# Altium schematic sheet I2C P Sensor.SchDoc: Air Pressure Sensor
size 292 x 193 mm; SheetNumber: 11; SheetTotal: 21
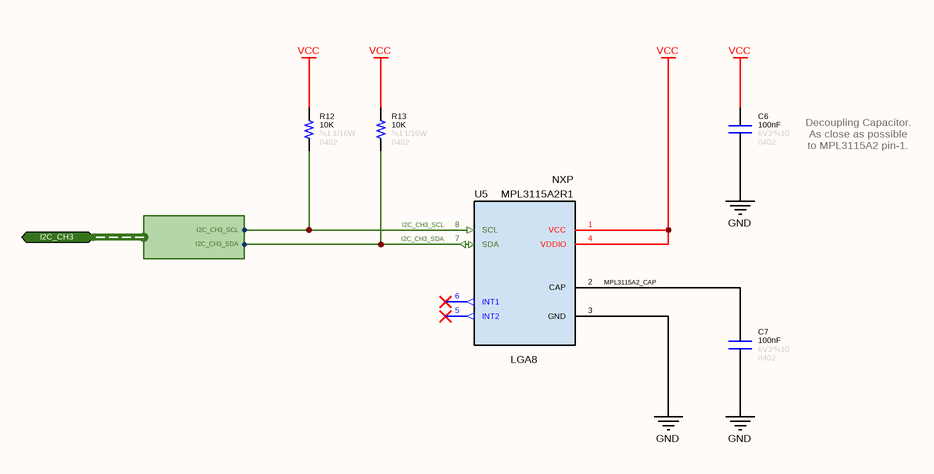
[diagram p0: I2C P Sensor.SchDoc]

## Parts
C6  value 100nF  Tolerance: %10  Voltage: 6V3  Case: 0402  [CAPACITOR_0402]  (hidden comment: Capacitor - 100nF [0402] (Ceramic))
C7  value 100nF  Tolerance: %10  Voltage: 6V3  Case: 0402  [CAPACITOR_0402]  (hidden comment: Capacitor - 100nF [0402] (Ceramic))
R12  value 10K  Tolerance: %1  Case: 0402  Power: 1/16W  [RESISTOR_0402]  (hidden comment: 10K - 0402 - %1 - 1/16W)
R13  value 10K  Tolerance: %1  Case: 0402  Power: 1/16W  [RESISTOR_0402]  (hidden comment: 10K - 0402 - %1 - 1/16W)
U5  Manufacturer Name: NXP  Case: LGA8  [MPL3115A2]  (hidden comment: MPL3115A2R1)

## Ports
I2C_CH3 (bidir, harness I2C_CH3)

## Harnesses
I2C_CH3: I2C_CH3_SCL, I2C_CH3_SDA

## Nets
GND: C6.1 C7.1 U5.3(GND)
VCC: C6.2 R12.2 R13.2 U5.1(VCC) U5.4(VDDIO)
I2C_CH3_SCL: R12.1 U5.8(SCL) ; port I2C_CH3.I2C_CH3_SCL
I2C_CH3_SDA: R13.1 U5.7(SDA) ; port I2C_CH3.I2C_CH3_SDA
MPL3115A2_CAP: C7.2 U5.2(CAP)

Not connected (* = marked no-connect by the designer): U5 5(INT2)* 6(INT1)*

## Notes on the sheet
- Decoupling Capacitor. As close as possible to MPL3115A2 pin-1.
- © 2021 All rights reserved.
  This document may not, in whole or in part, be copied, photocopied, reproduced, translated or converted to any electronic or machine readable from without prior written permission of Mehmet Günce Akkoyun.
  Engineer contact : akkoyun@me.com
- Property of
- Engineer :
- Date :
- Size :
- A4
- Time :
- Project :
- Page :
- /
- Customer :
- Product ID :
- Module ID :
- Version :
- File :
- Revision :

## Library data of the parts
C6 C7 = Capacitor - 100nF [0402-6V3]: Capacitor - 100nF [0402-6V3] (Ceramic); Manufacturer Name: AVX; Manufacturer Part Number: 04026D104KAT4A; ComponentLink1Description: Mouser; ComponentLink1URL: https://www.mouser.com.tr/ProductDetail/AVX/04026D104KAT4A?qs=sGAEpiMZZMs0AnBnWHyRQPg4iYkCw7IMED%2F4kpqgf7w%3D; ComponentLink2Description: DataSheet; ComponentLink2URL: https://www.mouser.com.tr/datasheet/2/40/cx5r-776519.pdf
R12 R13 = Resistor - 10K [0402]: Thick Film Resistors - SMD 1/16 W 10 KOhm 1%; Manufacturer Name: Vishay; Manufacturer Part Number: CRCW040210K0FKED; ComponentLink1Description: DataSheet; ComponentLink1URL: https://www.mouser.com.tr/datasheet/2/427/dcrcwe3-1762152.pdf; ComponentLink2Description: Mouser; ComponentLink2URL: https://www.mouser.com.tr/ProductDetail/Vishay-Dale/CRCW040210K0FKED?qs=sGAEpiMZZMu61qfTUdNhG2DpbjADlD3GcalbOv9utCY%3D
U5 = IC - MPL3115A2R1: Board Mount Pressure Sensors; Operating Pressure: 20 kPa to 110 kPa; RoHS: Yes; Product Type: Absolute Pressure Sensors; Manufacturer Part Number: MPL3115A2R1